# EAGLE schematic receiver (EAGLE 9.3.0)
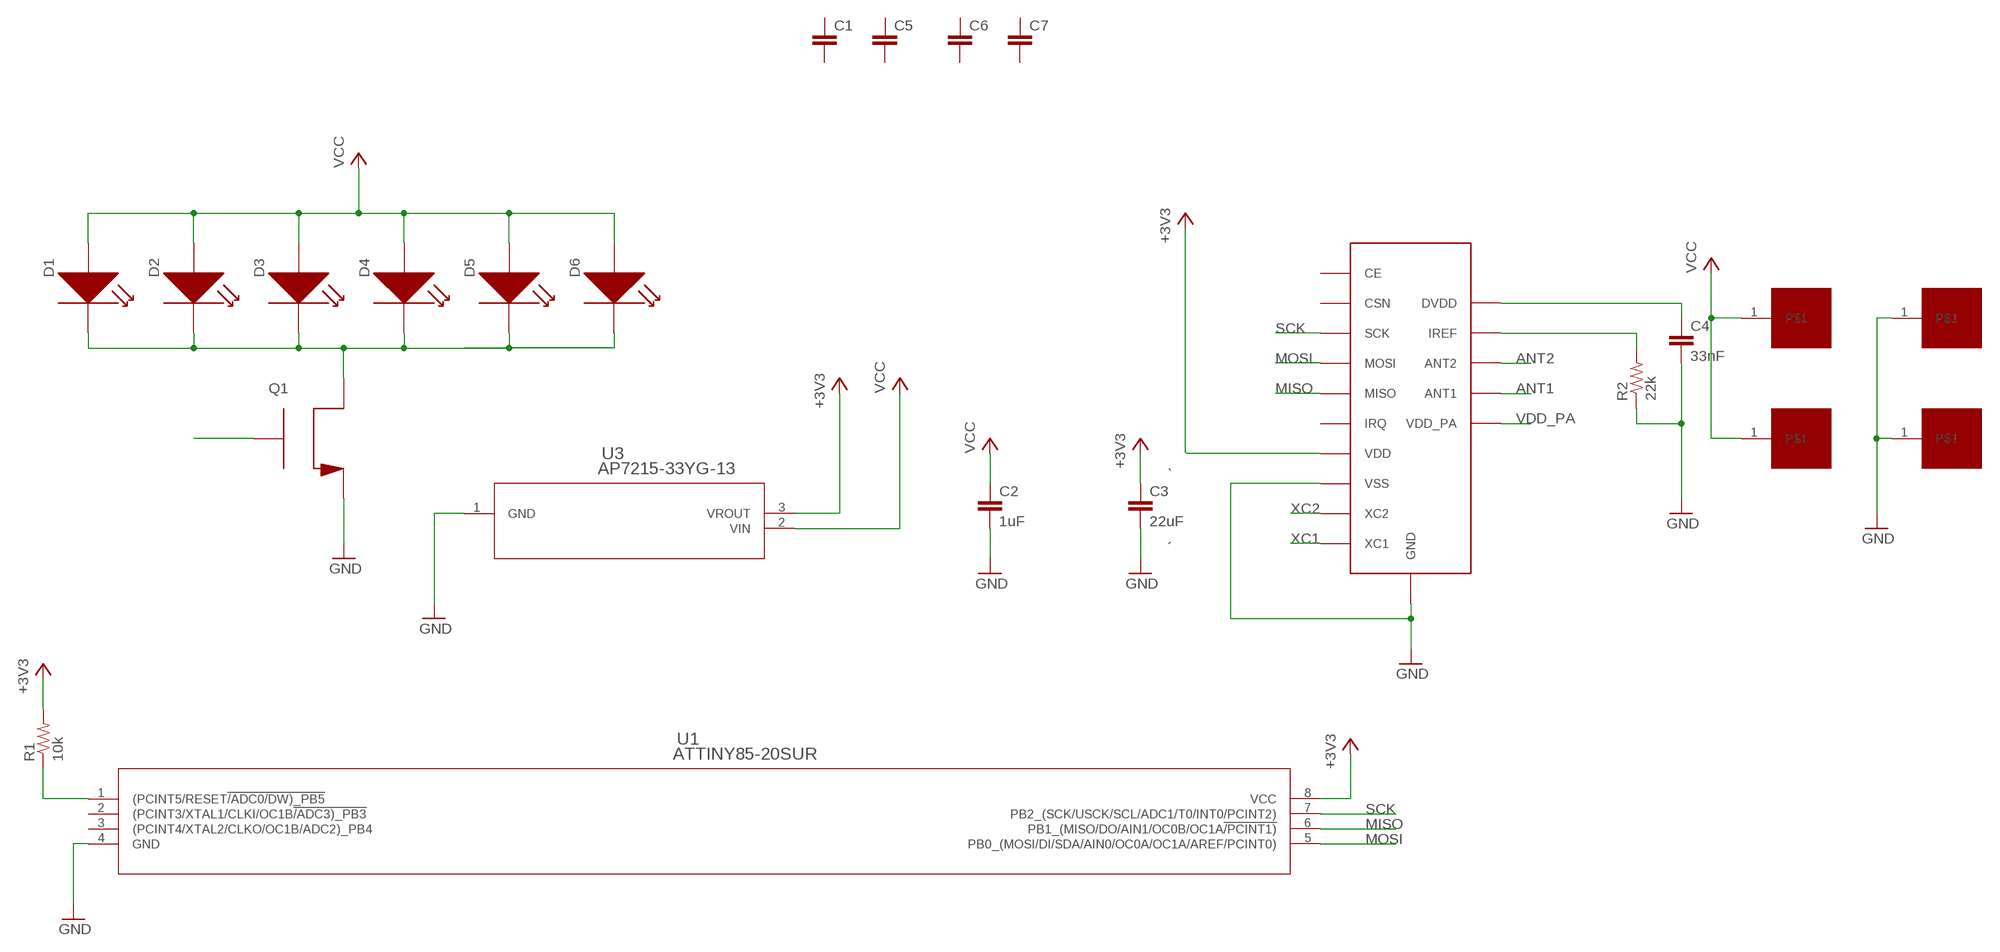
[diagram p0: schematic, sheet 1]

## Parts
C1  C-EUC0402  [C0402]
C2  1uF  C-EUC0402  [C0402]
C3  22uF  C-EUC0805  [C0805]
C4  33nF  C-EUC0402  [C0402]
C5  C-EUC0402  [C0402]
C6  C-EUC0402  [C0402]
C7  C-EUC0402  [C0402]
D1  NVSLE21AT  [NVSLE21AT]
D2  NVSLE21AT  [NVSLE21AT]
D3  NVSLE21AT  [NVSLE21AT]
D4  NVSLE21AT  [NVSLE21AT]
D5  NVSLE21AT  [NVSLE21AT]
D6  NVSLE21AT  [NVSLE21AT]
P1  PAD  [PAD]
P2  PAD  [PAD]
P3  PAD  [PAD]
P4  PAD  [PAD]
Q1  SIA436DJ  [POWERPAK_SC70-6L]
R1  10k  R-US_R0805  [R0805]
R2  22k  R-US_R0402  [R0402]
U1  ATTINY85-20SUR  [8S2]
U2  NRF24L01  [QFN20_4X4]
U3  AP7215-33YG-13  [SOT89-3L]

## Nets
+3V3: C3.1 R1.2 U1.8(VCC) U2.7(VDD) U2.15(VDD) U2.18(VDD) U3.3(VROUT)
ANT1: U2.12(ANT1)
ANT2: U2.13(ANT2)
GND: C2.2 C3.2 C4.2 P3.1 P4.1 Q1.P$2(S) Q1.P$3(S) R2.1 U1.4(GND) U2.8(VSS) U2.14(VSS) U2.17(VSS) U2.20(VSS) U2.P$21(GND) U3.1(GND)
MISO: U1.6(PB1_(MISO/DO/AIN1/OC0B/OC1A!/PCINT1)) U2.5(MISO)
MOSI: U1.5(PB0_(MOSI/DI/SDA/AIN0/OC0A/OC1A/AREF/PCINT0)) U2.4(MOSI)
N$1: D1.P$1(CATHODE) D2.P$1(CATHODE) D3.P$1(CATHODE) D4.P$1(CATHODE) D5.P$1(CATHODE) D6.P$1(CATHODE) Q1.P$1(D) Q1.P$5(D) Q1.P$6(D) Q1.P$7(D) Q1.P$8(D)
N$2: R1.1 U1.1((PCINT5/RESET!/ADC0/DW)_PB5)
N$3: Q1.P$4(G)
N$4: C4.1 U2.19(DVDD)
N$5: R2.2 U2.16(IREF)
SCK: U1.7(PB2_(SCK/USCK/SCL/ADC1/T0/INT0/PCINT2)) U2.3(SCK)
VCC: C2.1 D1.P$2(ANODE) D2.P$2(ANODE) D3.P$2(ANODE) D4.P$2(ANODE) D5.P$2(ANODE) D6.P$2(ANODE) P1.1 P2.1 U3.2(VIN)
VDD_PA: U2.11(VDD_PA)
XC1: U2.10(XC1)
XC2: U2.9(XC2)
Unconnected: C1.1 C1.2 C5.1 C5.2 C6.1 C6.2 C7.1 C7.2 U1.2((PCINT3/XTAL1/CLKI/OC1B!/ADC3)_PB3) U1.3((PCINT4/XTAL2/CLKO/OC1B/ADC2)_PB4) U2.1(CE) U2.2(CSN) U2.6(IRQ)

## Library data of the parts
C1-C7 = resistor:C-EU: CAPACITOR, European symbol
D1-D6 = leds:NVSLE21AT
P1-P4 = pad:PAD
Q1 = transistors:SIA436DJ
R1 R2 = resistor:R-US_: RESISTOR, American symbol
U1 = attiny85:ATTINY85-20SUR; MANUFACTURER_PART_NUMBER: ATTINY8520SUR; VENDOR: Atmel
U2 = nrf24l01:NRF24L01
U3 = AP7215-33YG-13:AP7215-33YG-13; MANUFACTURER_PART_NUMBER: AP721533YG13; VENDOR: Diodes Inc